# Altium schematic sheet NNP-DWG-125-001-000 PG4 Schematic Drawing Pg2.SchDoc
size B; Address1: 300 Artino St.; Address2: Oberlin, OH 44074; DocumentNumber: 51-2002-01; Revision: 04; SheetNumber: 2; SheetTotal: 8; PageSetup: Record=PageOptions|CenterHorizontal=True|CenterVertical=True|PrintScale=1.09|XCorrection=1.00|YCorrection=1.00|PrintKind=0|BorderSize=5000000|LeftOffset=0|BottomOffset=0|Orientation=2|PaperLength=4318|PaperWidth=2794|Scale=100|PaperSource=7|PrintQuality=-3|MediaType=1|DitherType=10|PrintScaleMode=1|PaperKind=11" x 17"|PaperIndex=17; DocName: **
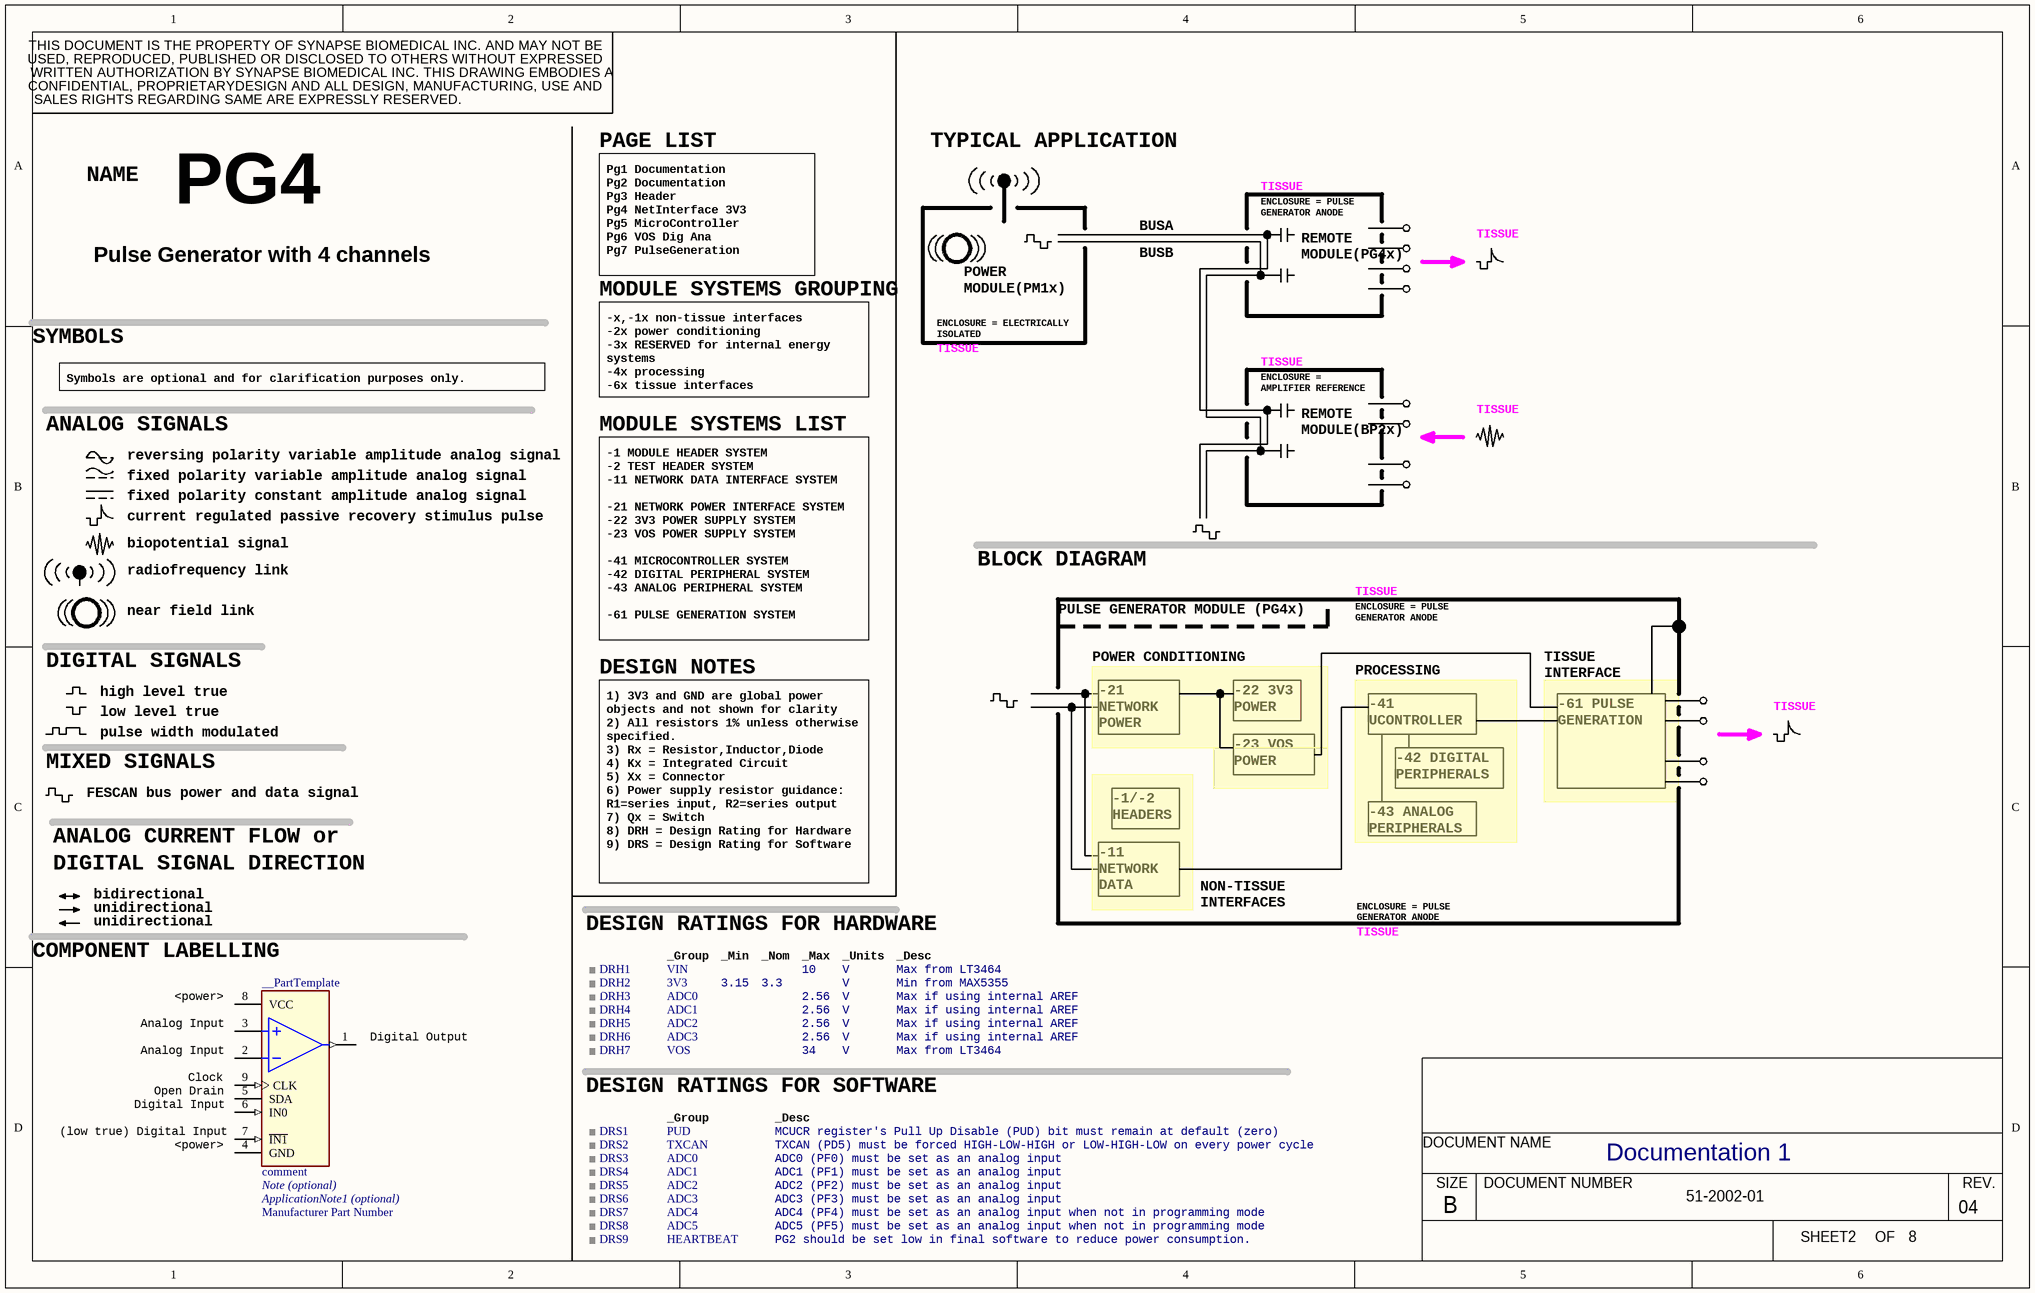
[diagram p0: NNP-DWG-125-001-000 PG4 Schematic Drawing Pg2.SchDoc]

## Parts
__PartTemplate  comment  Note: Note (optional)  AN1: ApplicationNote1 (optional)  MPN: Manufacturer Part Number  (graphical)
DRH1  _Desc: Max from LT3464  _Units: V  _Max: 10  _Parent: VIN  (hidden comment: DRT4)  (graphical)
DRH2  _Desc: Min from MAX5355  _Units: V  _Min: 3.15  _Nom: 3.3  _Parent: 3V3  (hidden comment: DRT4)  (graphical)
DRH3  _Desc: Max if using internal AREF  _Units: V  _Max: 2.56  _Parent: ADC0  (hidden comment: DRT4)  (graphical)
DRH4  _Desc: Max if using internal AREF  _Units: V  _Max: 2.56  _Parent: ADC1  (hidden comment: DRT4)  (graphical)
DRH5  _Desc: Max if using internal AREF  _Units: V  _Max: 2.56  _Parent: ADC2  (hidden comment: DRT4)  (graphical)
DRH6  _Desc: Max if using internal AREF  _Units: V  _Max: 2.56  _Parent: ADC3  (hidden comment: DRT4)  (graphical)
DRH7  _Desc: Max from LT3464  _Units: V  _Max: 34  _Parent: VOS  (hidden comment: DRT4)  (graphical)
DRS1  _Desc: MCUCR register's Pull Up Disable (PUD) bit must remain at default (zero)  _Parent: PUD  (hidden comment: DRT4)  (graphical)
DRS2  _Desc: TXCAN (PD5) must be forced HIGH-LOW-HIGH or LOW-HIGH-LOW on every power cycle  _Parent: TXCAN  (hidden comment: DRT4)  (graphical)
DRS3  _Desc: ADC0 (PF0) must be set as an analog input  _Parent: ADC0  (hidden comment: DRT4)  (graphical)
DRS4  _Desc: ADC1 (PF1) must be set as an analog input  _Parent: ADC1  (hidden comment: DRT4)  (graphical)
DRS5  _Desc: ADC2 (PF2) must be set as an analog input  _Parent: ADC2  (hidden comment: DRT4)  (graphical)
DRS6  _Desc: ADC3 (PF3) must be set as an analog input  _Parent: ADC3  (hidden comment: DRT4)  (graphical)
DRS7  _Desc: ADC4 (PF4) must be set as an analog input when not in programming mode  _Parent: ADC4  (hidden comment: DRT4)  (graphical)
DRS8  _Desc: ADC5 (PF5) must be set as an analog input when not in programming mode  _Parent: ADC5  (hidden comment: DRT4)  (graphical)
DRS9  _Desc: PG2 should be set low in final software to reduce power consumption.  _Parent: HEARTBEAT  (hidden comment: DRT4)  (graphical)

## Nets

Not connected (* = marked no-connect by the designer): __PartTemplate 1(OUTA) 2(INA-) 3(AIN) 4(GND) 5(SDA) 6(IN0) 7(~{IN1}) 8(VCC) 9(CLK)

## Notes on the sheet
- PAGE LIST
- TYPICAL APPLICATION
- NAME
- PG4
- BUSA
- TISSUE
- ENCLOSURE = PULSE GENERATOR ANODE
- Pulse Generator with 4 channels
- MODULE SYSTEMS GROUPING
- Pg1 Documentation
  Pg2 Documentation
  Pg3 Header
  Pg4 NetInterface 3V3
  Pg5 MicroController
  Pg6 VOS Dig Ana
  Pg7 PulseGeneration
- POWER MODULE(PM1x)
- BUSB
- REMOTE MODULE(PG4x)
- SYMBOLS
- ENCLOSURE = ELECTRICALLY ISOLATED
- ANALOG SIGNALS
- Symbols are optional and for clarification purposes only.
- MODULE SYSTEMS LIST
- -x,-1x non-tissue interfaces
  -2x power conditioning
  -3x RESERVED for internal energy systems
  -4x processing
  -6x tissue interfaces
- ENCLOSURE = AMPLIFIER REFERENCE
- fixed polarity variable amplitude analog signal
- fixed polarity constant amplitude analog signal
- reversing polarity variable amplitude analog signal
- REMOTE MODULE(BP2x)
- current regulated passive recovery stimulus pulse
- biopotential signal
- BLOCK DIAGRAM
- radiofrequency link
- near field link
- -1 MODULE HEADER SYSTEM
  -2 TEST HEADER SYSTEM
  -11 NETWORK DATA INTERFACE SYSTEM
  -21 NETWORK POWER INTERFACE SYSTEM
  -22 3V3 POWER SUPPLY SYSTEM
  -23 VOS POWER SUPPLY SYSTEM
  -41 MICROCONTROLLER SYSTEM
  -42 DIGITAL PERIPHERAL SYSTEM
  -43 ANALOG PERIPHERAL SYSTEM
  -61 PULSE GENERATION SYSTEM
- PULSE GENERATOR MODULE (PG4x)
- DIGITAL SIGNALS
- high level true
- DESIGN NOTES
- POWER CONDITIONING
- PROCESSING
- TISSUE INTERFACE
- MIXED SIGNALS
- low level true
- pulse width modulated
- -21 NETWORK POWER
- -22 3V3 POWER
- -23 VOS POWER
- -41 UCONTROLLER
- FESCAN bus power and data signal
- -1/-2  HEADERS
- -43 ANALOG PERIPHERALS
- -42 DIGITAL PERIPHERALS
- -61 PULSE GENERATION
- ANALOG CURRENT FLOW or
- DIGITAL SIGNAL DIRECTION
- bidirectional
- unidirectional
- 1) 3V3 and GND are global power objects and not shown for clarity
  2) All resistors 1% unless otherwise specified.
  3) Rx = Resistor,Inductor,Diode
  4) Kx = Integrated Circuit
  5) Xx = Connector
  6) Power supply resistor guidance: R1=series input, R2=series output
  7) Qx = Switch
  8) DRH = Design Rating for Hardware
  9) DRS = Design Rating for Software
- -11 NETWORK DATA
- NON-TISSUE INTERFACES
- (near __PartTemplate) COMPONENT LABELLING
- DESIGN RATINGS FOR HARDWARE
- _Group
- _Min
- _Nom
- _Max
- _Units
- _Desc
- DESIGN RATINGS FOR SOFTWARE
- Documentation 1
- SALES RIGHTS REGARDING SAME ARE EXPRESSLY RESERVED.
- THIS DOCUMENT IS THE PROPERTY OF SYNAPSE BIOMEDICAL INC. AND MAY NOT BE
- USED, REPRODUCED, PUBLISHED OR DISCLOSED TO OTHERS WITHOUT EXPRESSED
- CONFIDENTIAL, PROPRIETARYDESIGN AND ALL DESIGN, MANUFACTURING, USE AND
- WRITTEN AUTHORIZATION BY SYNAPSE BIOMEDICAL INC. THIS DRAWING EMBODIES A
- DOCUMENT NAME
- SIZE
- B
- DOCUMENT NUMBER
- SHEET
- OF
- REV.
- (in symbol __PartTemplate) <power>; Analog Input; Digital Output; Clock; Open Drain; Digital Input; (low true) Digital Input

## Library data of the parts
__PartTemplate = __PartTemplate: MFR: Manufacturer
DRH1-DRH7 DRS1-DRS9 = DRT4: Design rating